# Altium schematic sheet tcrt 16 Sheet.SchDoc
size B; SheetNumber: 1; SheetTotal: 1
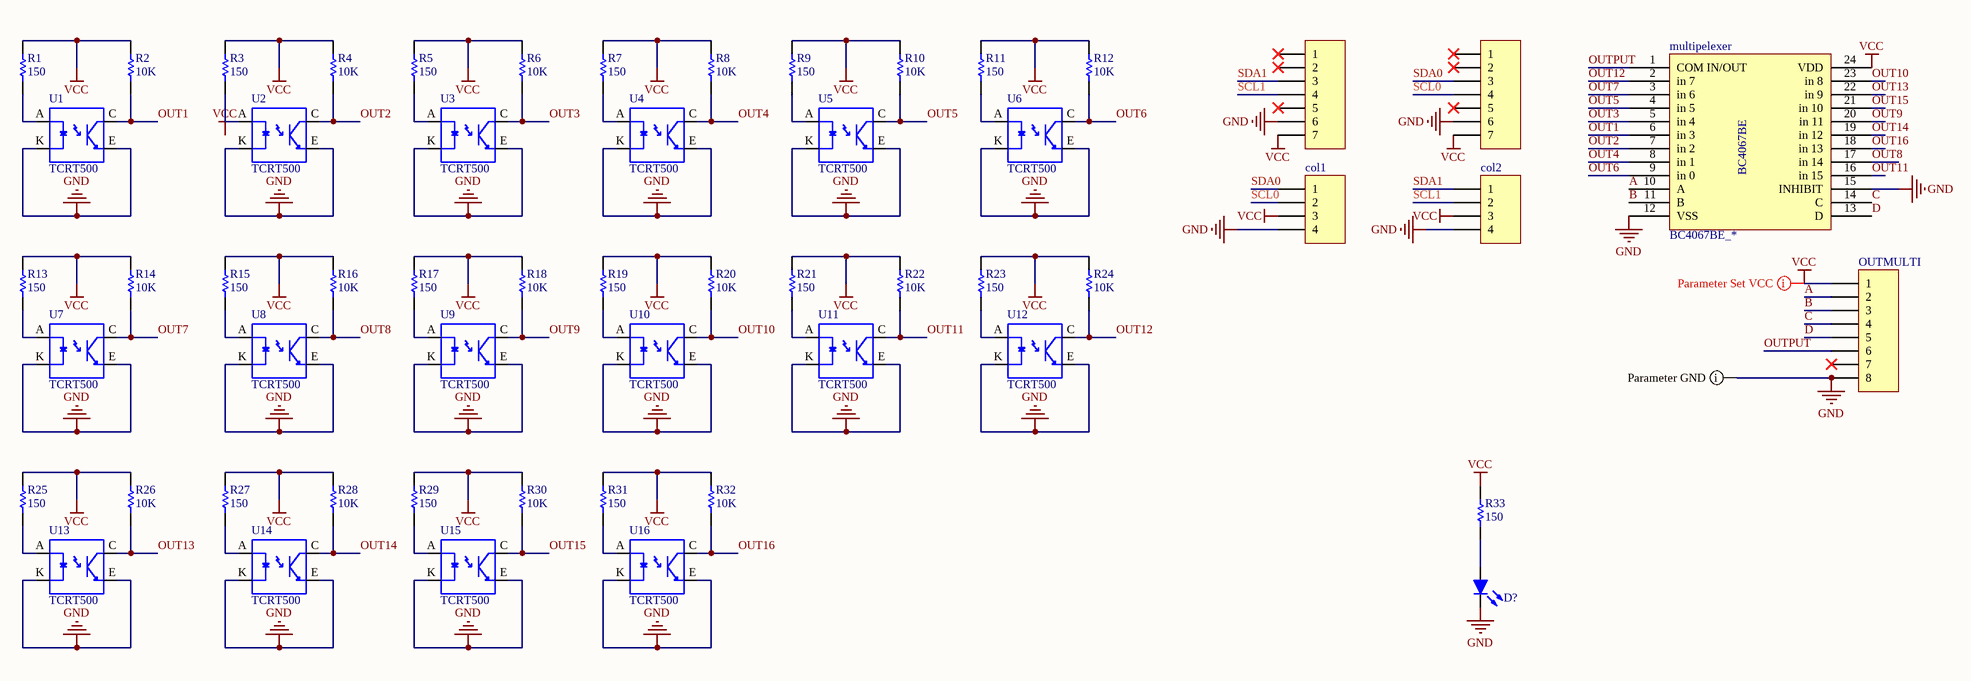
[diagram p0: tcrt 16 Sheet.SchDoc]

## Parts
1  Header 7  [HDR1X7]  (value not drawn)
2  Header 7  [HDR1X7]  (value not drawn)
col1  Header 4  [HDR1X4]  (value not drawn)
col2  Header 4  [HDR1X4]  (value not drawn)
D?  LED-SMD(0805)  [0805 LED]  (value not drawn)
multipelexer  BC4067BE_*  [PCBComponent_1]
OUTMULTI  Header 8  [HDR1X8]  (value not drawn)
R1  150  [0805]
R2  10K  [0805]
R3  150  [0805]
R4  10K  [0805]
R5  150  [0805]
R6  10K  [0805]
R7  150  [0805]
R8  10K  [0805]
R9  150  [0805]
R10  10K  [0805]
R11  150  [0805]
R12  10K  [0805]
R13  150  [0805]
R14  10K  [0805]
R15  150  [0805]
R16  10K  [0805]
R17  150  [0805]
R18  10K  [0805]
R19  150  [0805]
R20  10K  [0805]
R21  150  [0805]
R22  10K  [0805]
R23  150  [0805]
R24  10K  [0805]
R25  150  [0805]
R26  10K  [0805]
R27  150  [0805]
R28  10K  [0805]
R29  150  [0805]
R30  10K  [0805]
R31  150  [0805]
R32  10K  [0805]
R33  150  [1206]
U1  TCRT500  [TCRT5000]
U2  TCRT500  [TCRT5000]
U3  TCRT500  [TCRT5000]
U4  TCRT500  [TCRT5000]
U5  TCRT500  [TCRT5000]
U6  TCRT500  [TCRT5000]
U7  TCRT500  [TCRT5000]
U8  TCRT500  [TCRT5000]
U9  TCRT500  [TCRT5000]
U10  TCRT500  [TCRT5000]
U11  TCRT500  [TCRT5000]
U12  TCRT500  [TCRT5000]
U13  TCRT500  [TCRT5000]
U14  TCRT500  [TCRT5000]
U15  TCRT500  [TCRT5000]
U16  TCRT500  [TCRT5000]

## Nets
GND: 1.6 2.6 col1.4 col2.4 D?.2 multipelexer.12(VSS) multipelexer.15(INHIBIT) OUTMULTI.8 U1.E U1.K U2.E U2.K U3.E U3.K U4.E U4.K U5.E U5.K U6.E U6.K U7.E U7.K U8.E U8.K U9.E U9.K U10.E U10.K U11.E U11.K U12.E U12.K U13.E U13.K U14.E U14.K U15.E U15.K U16.E U16.K
VCC: 1.7 2.7 col1.3 col2.3 multipelexer.24(VDD) OUTMULTI.1 R1.2 R2.2 R3.2 R4.2 R5.2 R6.2 R7.2 R8.2 R9.2 R10.2 R11.2 R12.2 R13.2 R14.2 R15.2 R16.2 R17.2 R18.2 R19.2 R20.2 R21.2 R22.2 R23.2 R24.2 R25.2 R26.2 R27.2 R28.2 R29.2 R30.2 R31.2 R32.2 R33.1
A: multipelexer.10(A) OUTMULTI.2
B: multipelexer.11(B) OUTMULTI.3
C: multipelexer.14(C) OUTMULTI.4
D: multipelexer.13(D) OUTMULTI.5
OUT1: multipelexer.6(in_3) R2.1 U1.C
OUT2: multipelexer.7(in_2) R4.1 U2.C
OUT3: multipelexer.5(in_4) R6.1 U3.C
OUT4: multipelexer.8(in_1) R8.1 U4.C
OUT5: multipelexer.4(in_5) R10.1 U5.C
OUT6: multipelexer.9(in_0) R12.1 U6.C
OUT7: multipelexer.3(in_6) R14.1 U7.C
OUT8: multipelexer.17(in_14) R16.1 U8.C
OUT9: multipelexer.20(in_11) R18.1 U9.C
OUT10: multipelexer.23(in_8) R20.1 U10.C
OUT11: multipelexer.16(in_15) R22.1 U11.C
OUT12: multipelexer.2(in_7) R24.1 U12.C
OUT13: multipelexer.22(in_9) R26.1 U13.C
OUT14: multipelexer.19(in_12) R28.1 U14.C
OUT15: multipelexer.21(in_10) R30.1 U15.C
OUT16: multipelexer.18(in_13) R32.1 U16.C
OUTPUT: multipelexer.1(COM_IN/OUT) OUTMULTI.6
SCL0: 1.4 col1.2
SCL1: 2.4 col2.2
SDA0: 1.3 col1.1
SDA1: 2.3 col2.1
NetD?_1: D?.1 R33.2
NetR1_1: R1.1 U1.A
NetR3_1: R3.1 U2.A
NetR5_1: R5.1 U3.A
NetR7_1: R7.1 U4.A
NetR9_1: R9.1 U5.A
NetR11_1: R11.1 U6.A
NetR13_1: R13.1 U7.A
NetR15_1: R15.1 U8.A
NetR17_1: R17.1 U9.A
NetR19_1: R19.1 U10.A
NetR21_1: R21.1 U11.A
NetR23_1: R23.1 U12.A
NetR25_1: R25.1 U13.A
NetR27_1: R27.1 U14.A
NetR29_1: R29.1 U15.A
NetR31_1: R31.1 U16.A

Not connected (* = marked no-connect by the designer): 1 1* 2* 5*; 2 1* 2* 5*; OUTMULTI 7*

## Layout directives
rule Width Constraint [Pref Width = 1.2mm    Min Width = 1.7mm    Max Width = 2mm]: GND
rule Width Constraint [Pref Width = 1mm    Min Width = 1mm    Max Width = 1.5mm]: VCC

## Notes on the sheet
- Labels drawn without touching a wire or pin: VCC
- (in symbol BC4067BE_*) BC4067BE

## Library data of the parts
1 2 = Header 7: Header, 7-Pin; LatestRevisionDate: 17-Jul-2002; LatestRevisionNote: Re-released for DXP Platform.; Publisher: Altium Limited
col1 col2 = Header 4: Header, 4-Pin; LatestRevisionDate: 17-Jul-2002; LatestRevisionNote: Re-released for DXP Platform.; Publisher: Altium Limited
OUTMULTI = Header 8: Header, 8-Pin; LatestRevisionDate: 17-Jul-2002; LatestRevisionNote: Re-released for DXP Platform.; Publisher: Altium Limited
R1-R33 = RESISTOR_SMD: Choose your Favorite size from Footprint Section
U1-U16 = TCRT5000